# Altium project PCB_Project.PrjPcb
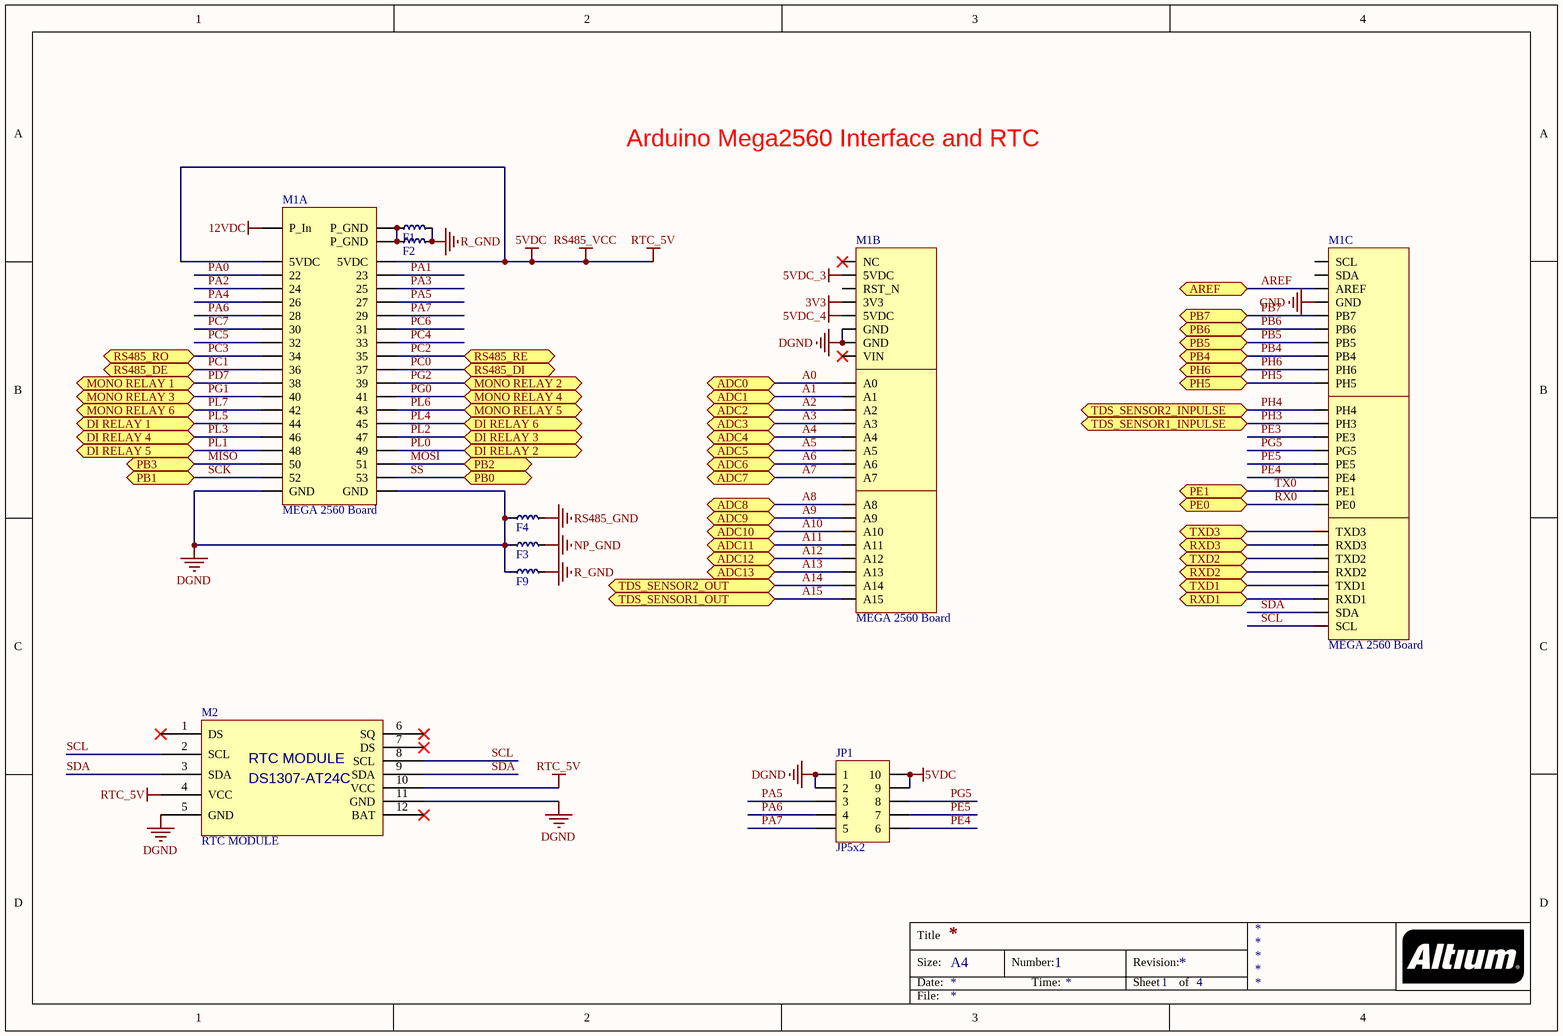
[diagram p0: Arduino_Mega2560.SchDoc]
5 sheets, 149 parts. Net scope: flat (ports and power ports of the same name join across sheets).
Board file: SmartAGR_Arduino_Version.PcbDoc
Sheets:
  Arduino_Mega2560.SchDoc
  Relay220VAC.SchDoc
  Relay12VDC.SchDoc
  RS485.SchDoc
  TDS sensor 1.SchDoc

## Sheet Arduino_Mega2560.SchDoc
size A4; DocumentNumber: 1; SheetNumber: 1; SheetTotal: 4

### Parts
F1  FBFB0805  [RESC_0603]  (value not drawn)
F2  FBFB0805  [RESC_0603]  (value not drawn)
F3  FBFB0805  [RESC_0603]  (value not drawn)
F4  FBFB0805  [RESC_0603]  (value not drawn)
F9  FBFB0805  [RESC_0603]  (value not drawn)
JP1  JP5x2  [JP5-D2T]
M1  MEGA 2560 Board  [MEGA 2560]  (parts A,B,C of 3)
M2  RTC MODULE  [MODULE RTC DS1307-AT24C]

### Ports
ADC0, ADC1, ADC2, ADC3, ADC4, ADC5, ADC6, ADC7, ADC8, ADC9, ADC10, ADC11, ADC12, ADC13, AREF, DI RELAY 1, DI RELAY 2, DI RELAY 3, DI RELAY 4, DI RELAY 5, DI RELAY 6, MONO RELAY 1, MONO RELAY 2, MONO RELAY 3, MONO RELAY 4, MONO RELAY 5, MONO RELAY 6, PB0, PB1, PB2, PB3, PB4, PB5, PB6, PB7, PE0, PE1, PH5, PH6, RS485_DE, RS485_DI, RS485_RE, RS485_RO, RXD1, RXD2, RXD3, TDS_SENSOR1_INPULSE, TDS_SENSOR1_OUT, TDS_SENSOR2_INPULSE, TDS_SENSOR2_OUT, TXD1, TXD2, TXD3

### Nets
3V3: M1.3V1(3V3)
5VDC: JP1.9 JP1.10 M1.5V1(5VDC) M1.5V2(5VDC) M2.4(VCC) M2.10(VCC)  [also labelled RS485_VCC, RTC_5V]
5VDC_3: M1.5V3(5VDC)
5VDC_4: M1.5V4(5VDC)
12VDC: M1.P_In
DGND: F3.1 F4.1 F9.1 JP1.1 JP1.2 M1.G1(GND) M1.G2(GND) M1.G3(GND) M1.G4(GND) M2.5(GND) M2.11(GND)
GND: M1.G5(GND)
NP_GND: F3.2
R_GND: F1.2 F2.2 F9.2
RS485_GND: F4.2
A0: M1.A0 ; port ADC0
A1: M1.A1 ; port ADC1
A2: M1.A2 ; port ADC2
A3: M1.A3 ; port ADC3
A4: M1.A4 ; port ADC4
A5: M1.A5 ; port ADC5
A6: M1.A6 ; port ADC6
A7: M1.A7 ; port ADC7
A8: M1.A8 ; port ADC8
A9: M1.A9 ; port ADC9
A10: M1.A10 ; port ADC10
A11: M1.A11 ; port ADC11
A12: M1.A12 ; port ADC12
A13: M1.A13 ; port ADC13
A14: M1.A14 ; port TDS_SENSOR2_OUT
A15: M1.A15 ; port TDS_SENSOR1_OUT
AREF: M1.AREF ; port AREF
MISO: M1.50 ; port PB3
MOSI: M1.51 ; port PB2
PA0: M1.22
PA1: M1.23
PA2: M1.24
PA3: M1.25
PA4: M1.26
PA5: JP1.3 M1.27
PA6: JP1.4 M1.28
PA7: JP1.5 M1.29
PB4: M1.10(PB4) ; port PB4
PB5: M1.11(PB5) ; port PB5
PB6: M1.12(PB6) ; port PB6
PB7: M1.13(PB7) ; port PB7
PC0: M1.37 ; port RS485_DI
PC1: M1.36 ; port RS485_DE
PC2: M1.35 ; port RS485_RE
PC3: M1.34 ; port RS485_RO
PC4: M1.33
PC5: M1.32
PC6: M1.31
PC7: M1.30
PD7: M1.38 ; port MONO RELAY 1
PE3: M1.5(PE3)
PE4: JP1.6 M1.2(PE4)
PE5: JP1.7 M1.3(PE5)
PG0: M1.41 ; port MONO RELAY 4
PG1: M1.40 ; port MONO RELAY 3
PG2: M1.39 ; port MONO RELAY 2
PG5: JP1.8 M1.4(PG5)
PH3: M1.6(PH3) ; port TDS_SENSOR1_INPULSE
PH4: M1.7(PH4) ; port TDS_SENSOR2_INPULSE
PH5: M1.8(PH5) ; port PH5
PH6: M1.9(PH6) ; port PH6
PL0: M1.49 ; port DI RELAY 2
PL1: M1.48 ; port DI RELAY 5
PL2: M1.47 ; port DI RELAY 3
PL3: M1.46 ; port DI RELAY 4
PL4: M1.45 ; port DI RELAY 6
PL5: M1.44 ; port DI RELAY 1
PL6: M1.43 ; port MONO RELAY 5
PL7: M1.42 ; port MONO RELAY 6
RX0: M1.0(PE0) ; port PE0
SCK: M1.52 ; port PB1
SCL: M1.21(SCL) M2.2(SCL) M2.8(SCL)
SDA: M1.20(SDA) M2.3(SDA) M2.9(SDA)
SS: M1.53 ; port PB0
TX0: M1.1(PE1) ; port PE1
NetF1_1: F1.1 F2.1 M1.PGND1(P_GND) M1.PGND2(P_GND)
NetM1_14: M1.14(TXD3) ; port TXD3
NetM1_15: M1.15(RXD3) ; port RXD3
NetM1_16: M1.16(TXD2) ; port TXD2
NetM1_17: M1.17(RXD2) ; port RXD2
NetM1_18: M1.18(TXD1) ; port TXD1
NetM1_19: M1.19(RXD1) ; port RXD1

Not connected (* = marked no-connect by the designer): M1 NC* RST(RST_N) SCL SDA VIN*; M2 1(DS)* 6(SQ)* 7(DS)* 12(BAT)*

### Notes on the sheet
- Arduino Mega2560 Interface and RTC
- Title
- Size:
- Date:
- A4
- Number:
- Time:
- Revision:
- Sheet
- of
- File:
- (in symbol RTC DS1307-AR24C) DS1307-AT24C

### Library data of the parts
F1-F4 F9 = FB0603_1000Ohm: FERRITE BEAD 1000 OHM 0603; Supplier 1: Digi-Key; Supplier Part Number 1: 587-1867-1-ND
JP1 = JP5x2: WR-PHD 2.54 mm Dual Socket Header; Manufacturer: W¨¹rth Elektronik eiSos GmbH; partNo: 61301021821; ComponentLink1 Description: Manufacturer; ComponentLink2 Description: Datasheet; NoPins: 10; Created Date: 29 March 2013; ComponentLink1URL: http://www.we-online.com; ComponentLink2URL: http://katalog.we-online.de/em/datasheet/6130xx21821.pdf; Created by: Karrer Zheng
M1 = MEGA 2560 Board: Arduino ATMEGA 2560
M2 = RTC DS1307-AR24C: RTC DS1307-AT24C

## Sheet Relay220VAC.SchDoc
size A4; DocumentNumber: 2; SheetNumber: 2; SheetTotal: 4
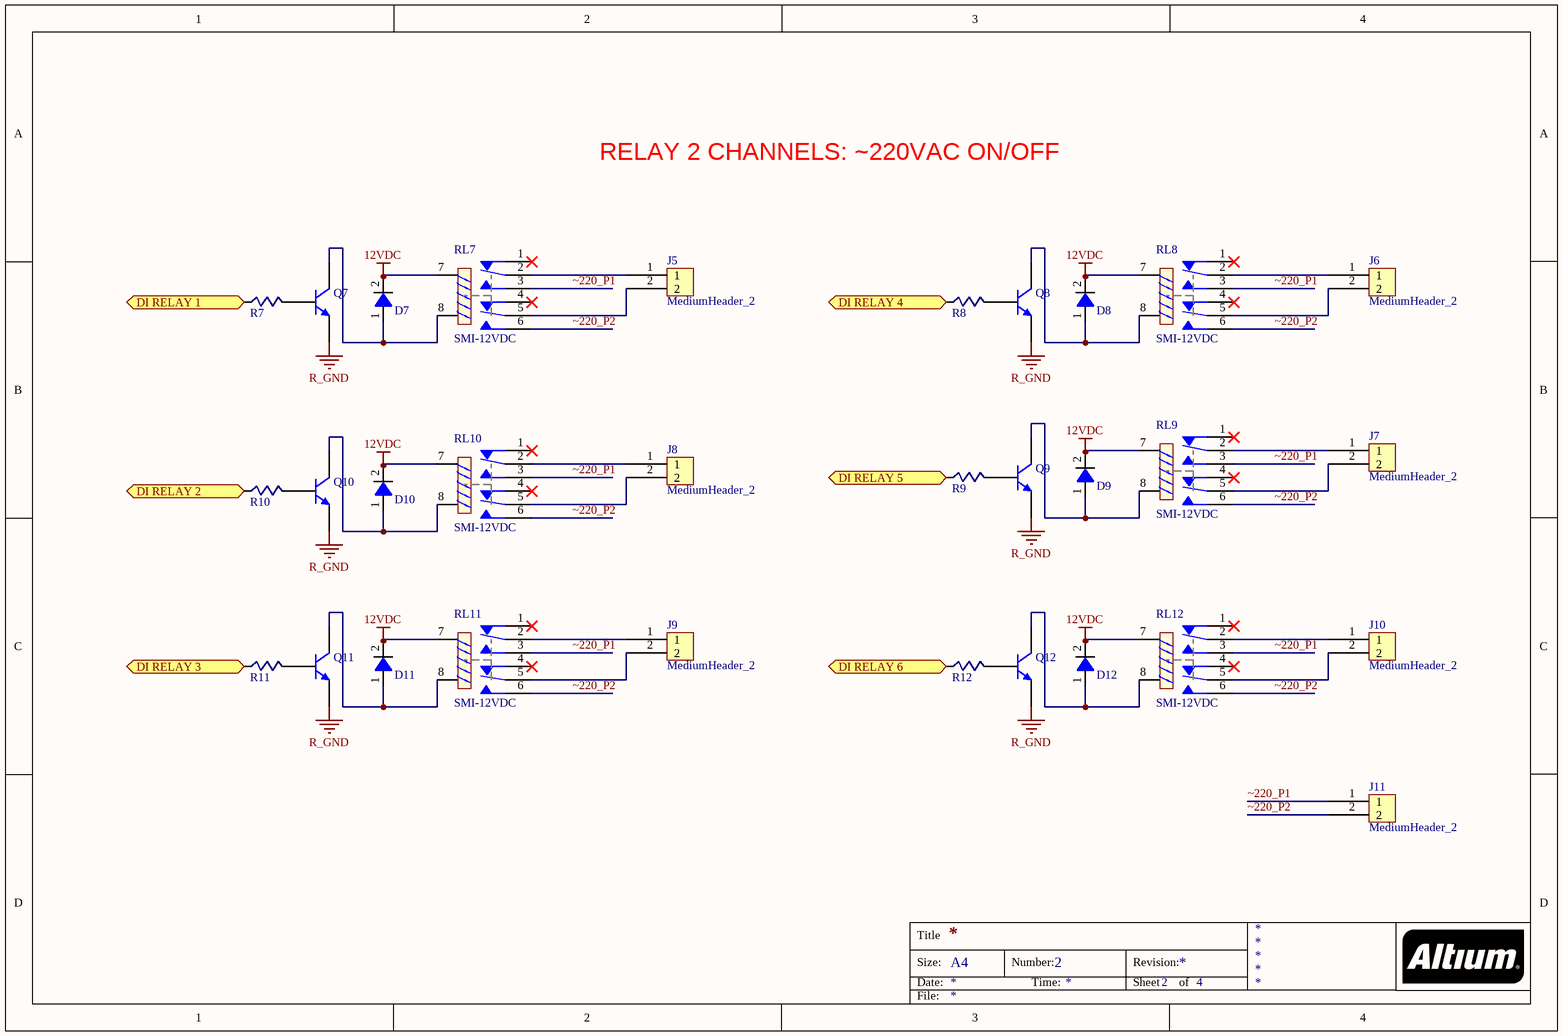
[diagram p1: Relay220VAC.SchDoc]

### Parts
D7  M7 SMD  [Diode 1N4007 SMD]  (value not drawn)
D8  M7 SMD  [Diode 1N4007 SMD]  (value not drawn)
D9  M7 SMD  [Diode 1N4007 SMD]  (value not drawn)
D10  M7 SMD  [Diode 1N4007 SMD]  (value not drawn)
D11  M7 SMD  [Diode 1N4007 SMD]  (value not drawn)
D12  M7 SMD  [Diode 1N4007 SMD]  (value not drawn)
J5  MediumHeader_2  [Medium - Header 2]
J6  MediumHeader_2  [Medium - Header 2]
J7  MediumHeader_2  [Medium - Header 2]
J8  MediumHeader_2  [Medium - Header 2]
J9  MediumHeader_2  [Medium - Header 2]
J10  MediumHeader_2  [Medium - Header 2]
J11  MediumHeader_2  [Medium - Header 2]
Q7  MMBT3904  [SOT23_L_MOD]  (value not drawn)
Q8  MMBT3904  [SOT23_L_MOD]  (value not drawn)
Q9  MMBT3904  [SOT23_L_MOD]  (value not drawn)
Q10  MMBT3904  [SOT23_L_MOD]  (value not drawn)
Q11  MMBT3904  [SOT23_L_MOD]  (value not drawn)
Q12  MMBT3904  [SOT23_L_MOD]  (value not drawn)
R7  R_1K_0603  [RES-SMD-0603]  (value not drawn)
R8  R_1K_0603  [RES-SMD-0603]  (value not drawn)
R9  R_1K_0603  [RES-SMD-0603]  (value not drawn)
R10  R_1K_0603  [RES-SMD-0603]  (value not drawn)
R11  R_1K_0603  [RES-SMD-0603]  (value not drawn)
R12  R_1K_0603  [RES-SMD-0603]  (value not drawn)
RL7  SMI-12VDC  [RELAY SMI-2P]
RL8  SMI-12VDC  [RELAY SMI-2P]
RL9  SMI-12VDC  [RELAY SMI-2P]
RL10  SMI-12VDC  [RELAY SMI-2P]
RL11  SMI-12VDC  [RELAY SMI-2P]
RL12  SMI-12VDC  [RELAY SMI-2P]

### Ports
DI RELAY 1, DI RELAY 2, DI RELAY 3, DI RELAY 4, DI RELAY 5, DI RELAY 6

### Nets
12VDC: D7.2 D8.2 D9.2 D10.2 D11.2 D12.2 RL7.7 RL8.7 RL9.7 RL10.7 RL11.7 RL12.7
R_GND: Q7.2(E) Q8.2(E) Q9.2(E) Q10.2(E) Q11.2(E) Q12.2(E)
PL0: R10.1 ; port DI RELAY 2
PL1: R9.1 ; port DI RELAY 5
PL2: R11.1 ; port DI RELAY 3
PL3: R8.1 ; port DI RELAY 4
PL4: R12.1 ; port DI RELAY 6
PL5: R7.1 ; port DI RELAY 1
~220_P1: J11.1 RL7.3 RL8.3 RL9.3 RL10.3 RL11.3 RL12.3
~220_P2: J11.2 RL7.6 RL8.6 RL9.6 RL10.6 RL11.6 RL12.6
NetD7_1: D7.1 Q7.3(C) RL7.8
NetD8_1: D8.1 Q8.3(C) RL8.8
NetD9_1: D9.1 Q9.3(C) RL9.8
NetD10_1: D10.1 Q10.3(C) RL10.8
NetD11_1: D11.1 Q11.3(C) RL11.8
NetD12_1: D12.1 Q12.3(C) RL12.8
NetJ5_1: J5.1 RL7.2
NetJ5_2: J5.2 RL7.5
NetJ6_1: J6.1 RL8.2
NetJ6_2: J6.2 RL8.5
NetJ7_1: J7.1 RL9.2
NetJ7_2: J7.2 RL9.5
NetJ8_1: J8.1 RL10.2
NetJ8_2: J8.2 RL10.5
NetJ9_1: J9.1 RL11.2
NetJ9_2: J9.2 RL11.5
NetJ10_1: J10.1 RL12.2
NetJ10_2: J10.2 RL12.5
NetQ7_1: Q7.1(B) R7.2
NetQ8_1: Q8.1(B) R8.2
NetQ9_1: Q9.1(B) R9.2
NetQ10_1: Q10.1(B) R10.2
NetQ11_1: Q11.1(B) R11.2
NetQ12_1: Q12.1(B) R12.2

Not connected (* = marked no-connect by the designer): RL7 1* 4*; RL8 1* 4*; RL9 1* 4*; RL10 1* 4*; RL11 1* 4*; RL12 1* 4*

### Notes on the sheet
- RELAY 2 CHANNELS: ~220VAC ON/OFF
- Title
- Size:
- Date:
- A4
- Number:
- Time:
- Revision:
- Sheet
- of
- File:

### Library data of the parts
D7-D12 = Diode_1N4007: DIODE GEN PURP 1KV 1A DO214AC; Supplier 1: Digi-Key; Supplier Part Number 1: 641-1018-1-ND
Q7-Q12 = MMBT3904: TRANSISTOR GP NPN AMP SOT-23; Published: 17-Sep-2003; LatestRevisionDate: 12-Dec-2006; LatestRevisionNote: IPC-7351 Footprint Added.; DatasheetVersion: 13-May-2002; PackageVersion: May-1999; PackageReference: SOT23; Publisher: Altium Limited; PackageDescription: 3-Pin SOT-23 Package 0.95 mm Pitch, 2.3 mm Lead Span; ComponentLink1Description: Manufacturer Link; ComponentLink1URL: http://www.semiconductors.philips.com/; ComponentLink2Description: Datasheet; ComponentLink2URL: http://www.semiconductors.philips.com/acrobat/datasheets/MMBT3904_4.pdf; Supplier 1: Digi-Key; Supplier Part Number 1: MMBT3904FSDKR-ND
R7-R12 = RES0603_1K: RES 1K OHM 1/10W 1% 0603 SMD; Supplier 1: Digi-Key; Supplier Part Number 1: 311-1.50KHRDKR-ND
RL7-RL12 = RELAY SMI-2P: Relay 12VDC, 2 channel

## Sheet Relay12VDC.SchDoc
size A4; DocumentNumber: 3; SheetNumber: 3; SheetTotal: 4
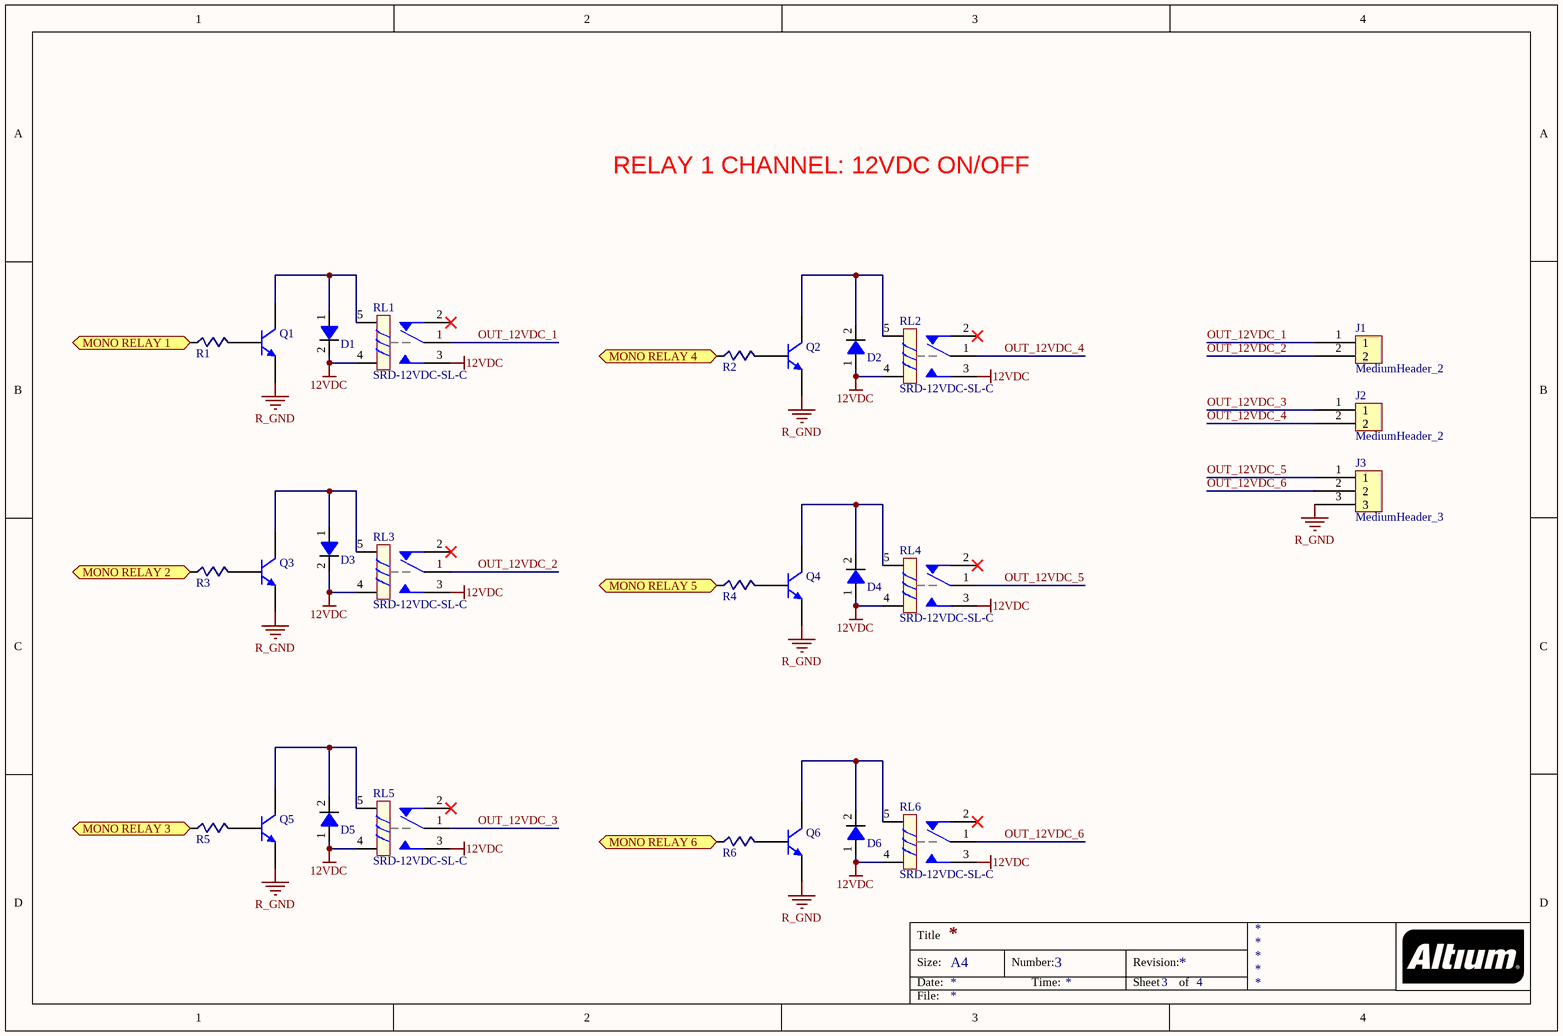
[diagram p2: Relay12VDC.SchDoc]

### Parts
D1  M7 SMD  [Diode 1N4007 SMD]  (value not drawn)
D2  M7 SMD  [Diode 1N4007 SMD]  (value not drawn)
D3  M7 SMD  [Diode 1N4007 SMD]  (value not drawn)
D4  M7 SMD  [Diode 1N4007 SMD]  (value not drawn)
D5  M7 SMD  [Diode 1N4007 SMD]  (value not drawn)
D6  M7 SMD  [Diode 1N4007 SMD]  (value not drawn)
J1  MediumHeader_2  [Medium - Header 2]
J2  MediumHeader_2  [Medium - Header 2]
J3  MediumHeader_3  [Medium - Header 3]
Q1  MMBT3904  [SOT23_L_MOD]  (value not drawn)
Q2  MMBT3904  [SOT23_L_MOD]  (value not drawn)
Q3  MMBT3904  [SOT23_L_MOD]  (value not drawn)
Q4  MMBT3904  [SOT23_L_MOD]  (value not drawn)
Q5  MMBT3904  [SOT23_L_MOD]  (value not drawn)
Q6  MMBT3904  [SOT23_L_MOD]  (value not drawn)
R1  R_1K_0603  [RES-SMD-0603]  (value not drawn)
R2  R_1K_0603  [RES-SMD-0603]  (value not drawn)
R3  R_1K_0603  [RES-SMD-0603]  (value not drawn)
R4  R_1K_0603  [RES-SMD-0603]  (value not drawn)
R5  R_1K_0603  [RES-SMD-0603]  (value not drawn)
R6  R_1K_0603  [RES-SMD-0603]  (value not drawn)
RL1  SRD-12VDC-SL-C  [RELAY SRD-12VDC]
RL2  SRD-12VDC-SL-C  [RELAY SRD-12VDC]
RL3  SRD-12VDC-SL-C  [RELAY SRD-12VDC]
RL4  SRD-12VDC-SL-C  [RELAY SRD-12VDC]
RL5  SRD-12VDC-SL-C  [RELAY SRD-12VDC]
RL6  SRD-12VDC-SL-C  [RELAY SRD-12VDC]

### Ports
MONO RELAY 1, MONO RELAY 2, MONO RELAY 3, MONO RELAY 4, MONO RELAY 5, MONO RELAY 6

### Nets
12VDC: D1.2 D2.1 D3.2 D4.1 D5.1 D6.1 RL1.3 RL1.4 RL2.3 RL2.4 RL3.3 RL3.4 RL4.3 RL4.4 RL5.3 RL5.4 RL6.3 RL6.4
R_GND: J3.3 Q1.2(E) Q2.2(E) Q3.2(E) Q4.2(E) Q5.2(E) Q6.2(E)
OUT_12VDC_1: J1.1 RL1.1
OUT_12VDC_2: J1.2 RL3.1
OUT_12VDC_3: J2.1 RL5.1
OUT_12VDC_4: J2.2 RL2.1
OUT_12VDC_5: J3.1 RL4.1
OUT_12VDC_6: J3.2 RL6.1
PD7: R1.1 ; port MONO RELAY 1
PG0: R2.1 ; port MONO RELAY 4
PG1: R5.1 ; port MONO RELAY 3
PG2: R3.1 ; port MONO RELAY 2
PL6: R4.1 ; port MONO RELAY 5
PL7: R6.1 ; port MONO RELAY 6
NetD1_1: D1.1 Q1.3(C) RL1.5
NetD2_2: D2.2 Q2.3(C) RL2.5
NetD3_1: D3.1 Q3.3(C) RL3.5
NetD4_2: D4.2 Q4.3(C) RL4.5
NetD5_2: D5.2 Q5.3(C) RL5.5
NetD6_2: D6.2 Q6.3(C) RL6.5
NetQ1_1: Q1.1(B) R1.2
NetQ2_1: Q2.1(B) R2.2
NetQ3_1: Q3.1(B) R3.2
NetQ4_1: Q4.1(B) R4.2
NetQ5_1: Q5.1(B) R5.2
NetQ6_1: Q6.1(B) R6.2

Not connected (* = marked no-connect by the designer): RL1 2*; RL2 2*; RL3 2*; RL4 2*; RL5 2*; RL6 2*

### Notes on the sheet
- RELAY 1 CHANNEL: 12VDC ON/OFF
- Title
- Size:
- Date:
- A4
- Number:
- Time:
- Revision:
- Sheet
- of
- File:

### Library data of the parts
D1-D6 = Diode_1N4007: DIODE GEN PURP 1KV 1A DO214AC; Supplier 1: Digi-Key; Supplier Part Number 1: 641-1018-1-ND
Q1-Q6 = MMBT3904: TRANSISTOR GP NPN AMP SOT-23; Published: 17-Sep-2003; LatestRevisionDate: 12-Dec-2006; LatestRevisionNote: IPC-7351 Footprint Added.; DatasheetVersion: 13-May-2002; PackageVersion: May-1999; PackageReference: SOT23; Publisher: Altium Limited; PackageDescription: 3-Pin SOT-23 Package 0.95 mm Pitch, 2.3 mm Lead Span; ComponentLink1Description: Manufacturer Link; ComponentLink1URL: http://www.semiconductors.philips.com/; ComponentLink2Description: Datasheet; ComponentLink2URL: http://www.semiconductors.philips.com/acrobat/datasheets/MMBT3904_4.pdf; Supplier 1: Digi-Key; Supplier Part Number 1: MMBT3904FSDKR-ND
R1-R6 = RES0603_1K: RES 1K OHM 1/10W 1% 0603 SMD; Supplier 1: Digi-Key; Supplier Part Number 1: 311-1.50KHRDKR-ND
RL1-RL6 = RELAY SRD-12VDC: Relay SPDT,10A - 12VDC 5 Pin; Value: Relay SPDT, 10A, 12V

## Sheet RS485.SchDoc
size A4
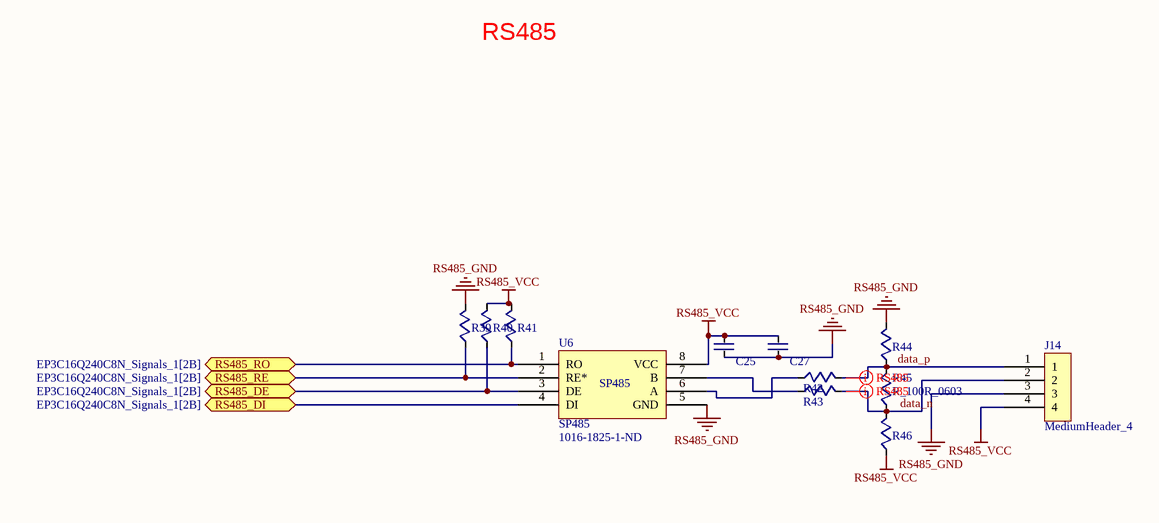
[diagram p3: RS485.SchDoc]

### Parts
C25  100n Cer  [CN-SMD-0805]  (value not drawn)
C27  10n Cer  [CN-SMD-0805]  (value not drawn)
J14  MediumHeader_4  [Medium - Header 4]
R39  R_10K_0603  [RESC_0603]  (value not drawn)
R40  R_10K_0603  [RESC_0603]  (value not drawn)
R41  R_4K99_0603  [RESC_0603]  (value not drawn)
R42  R_10K_0603  [RESC_0603]  (value not drawn)
R43  R_10R_0603  [RESC_0603]  (value not drawn)
R44  R_2K_0603  [RESC_0603]  (value not drawn)
R45  R_100R_0603  [RESC_0603]
R46  R_2K_0603  [RESC_0603]  (value not drawn)
U6  SP485  Supplier Part Number 1: 1016-1825-1-ND  [SOP8]

### Ports
RS485_DE (see EP3C16Q240C8N_Signals_1[2B]), RS485_DI (see EP3C16Q240C8N_Signals_1[2B]), RS485_RE (see EP3C16Q240C8N_Signals_1[2B]), RS485_RO (see EP3C16Q240C8N_Signals_1[2B])

### Nets
RS485_GND: C25.1 C27.1 J14.3 R39.2 R44.2 U6.5(GND)
RS485_VCC: C25.2 C27.2 J14.4 R40.2 R41.2 R46.1 U6.8(VCC)  [project net 5VDC]
data_n: J14.2 R43.2 R45.1 R46.2
data_p: J14.1 R42.2 R44.1 R45.2
PC0: U6.4(DI) ; port RS485_DI
PC1: R40.1 U6.3(DE) ; port RS485_DE
PC2: R39.1 U6.2(RE*) ; port RS485_RE
PC3: R41.1 U6.1(RO) ; port RS485_RO
NetR42_1: R42.1 U6.6(A)
NetR43_1: R43.1 U6.7(B)

### Layout directives
differential pair: data_n, data_p

### Notes on the sheet
- RS485
- Title
- Size:
- Date:
- A4
- Number:
- Time:
- Revision:
- Sheet
- of
- File:

### Library data of the parts
C25 = CAPC0805_104: CAP CER 0.1UF 25V 10% X7R 0805; Supplier 1: Digi-Key; Supplier Part Number 1: 399-1168-2-ND
C27 = CAPC0805_103: CAP CER 10000PF 100V X7R 0805; Supplier 1: Digi-Key; Supplier Part Number 1: 399-1159-1-ND
R39 R40 R42 = RES0603_10K: RES 10.0K OHM 1/10W 1% 0603 SMD; Supplier 1: Digi-Key; Supplier Part Number 1: 311-10.0KHRCT-ND
R41 = RES0603_4K99: RES 4.99K OHM 1/10W 1% 0603 SMD; Supplier 1: Digi-Key; Supplier Part Number 1: P4.99KHDKR-ND
R43 = RES0603_10R: RES 10.0 OHM 1/10W 0603 SMD; Supplier 1: Digi-Key; Supplier Part Number 1: 311-10.0HRCT-ND
R44 R46 = RES0603_2K: RES 2K OHM 1/10W 0603 SMD; Supplier 1: Digi-Key; Supplier Part Number 1: P2.0KDBDKR-ND
R45 = RES0603_100R: RES 100 OHM 1/10W 5% 0603 SMD; Supplier 1: Digi-Key; Supplier Part Number 1: P100GDKR-ND
U6 = SP485: IC TXRX RS485 HALF DUPLEX 8SOIC; Supplier 1: Digi-Key

## Sheet TDS sensor 1.SchDoc
size A4; DocumentNumber: 4; SheetNumber: 4; SheetTotal: 4
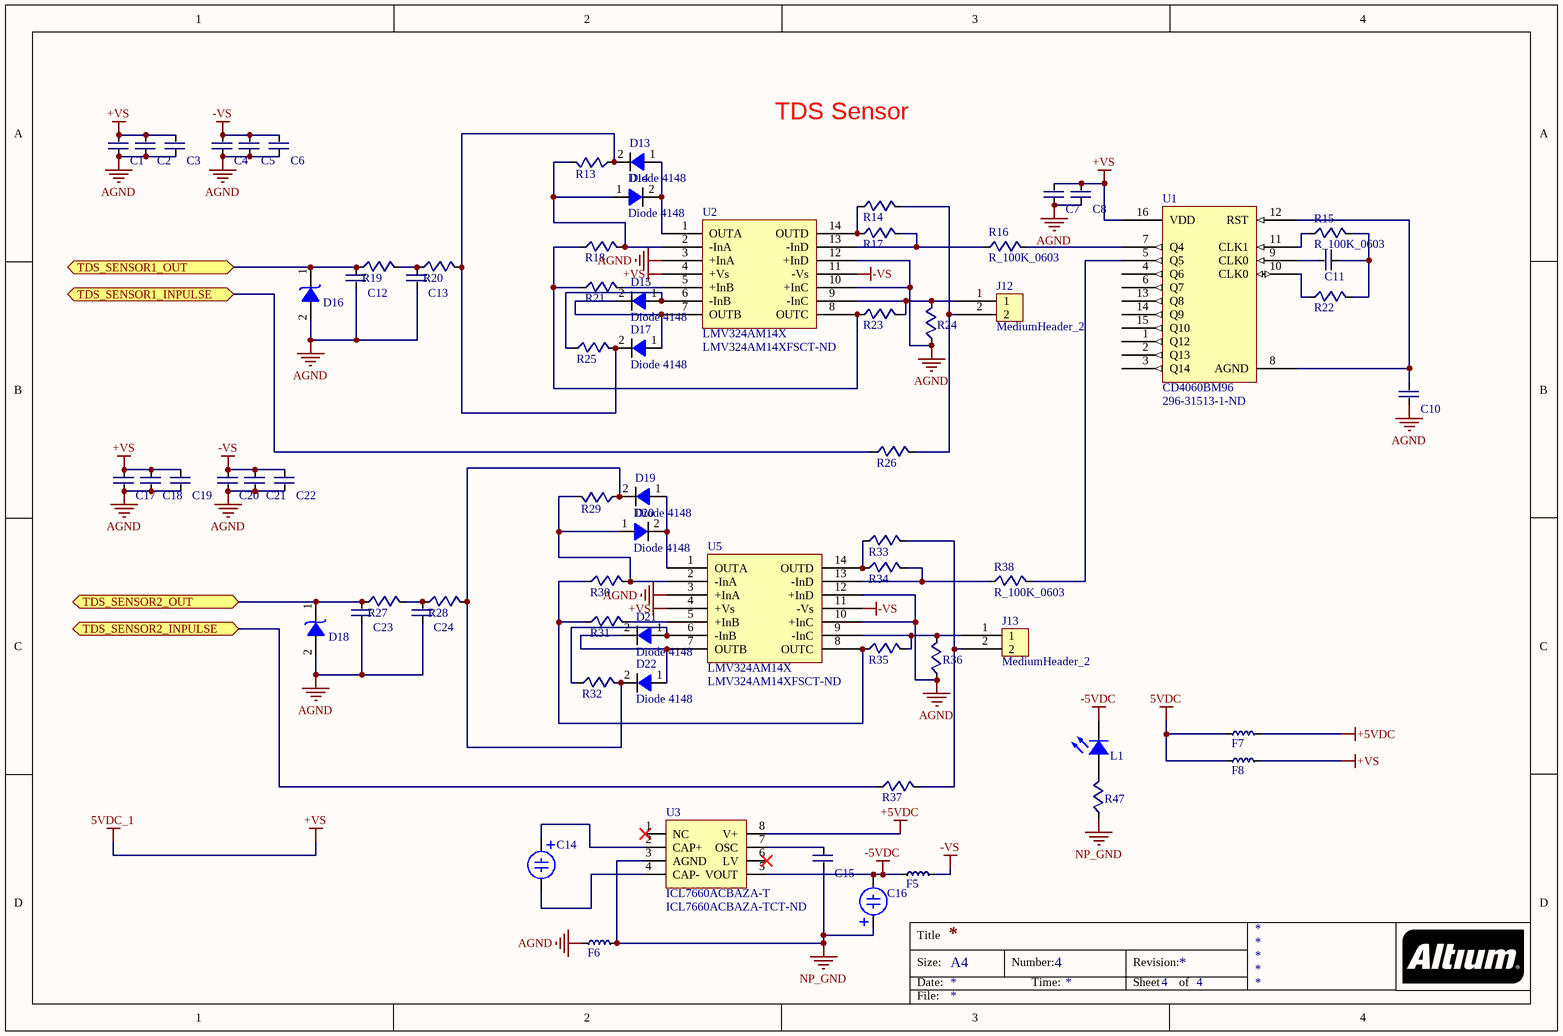
[diagram p4: TDS sensor 1.SchDoc]

### Parts
C1  100n Cer  [CN-SMD-0805]  (value not drawn)
C2  1n Cer  [CN-SMD-0805]  (value not drawn)
C3  10n Cer  [CN-SMD-0805]  (value not drawn)
C4  100n Cer  [CN-SMD-0805]  (value not drawn)
C5  1n Cer  [CN-SMD-0805]  (value not drawn)
C6  10n Cer  [CN-SMD-0805]  (value not drawn)
C7  10n Cer  [CN-SMD-0805]  (value not drawn)
C8  100n Cer  [CN-SMD-0805]  (value not drawn)
C10  100n Cer  [CN-SMD-0805]  (value not drawn)
C11  1n Cer  [CN-SMD-0805]  (value not drawn)
C12  10u Cer  [CN-SMD-0805]  (value not drawn)
C13  10u Cer  [CN-SMD-0805]  (value not drawn)
C14  CAP ALUM 100UF 25V 20% SMDL  [CAPALU_SM_5.3x5.3]  (value not drawn)
C15  100n Cer  [CN-SMD-0805]  (value not drawn)
C16  CAP ALUM 100UF 25V 20% SMDL  [CAPALU_SM_5.3x5.3]  (value not drawn)
C17  100n Cer  [CN-SMD-0805]  (value not drawn)
C18  1n Cer  [CN-SMD-0805]  (value not drawn)
C19  10n Cer  [CN-SMD-0805]  (value not drawn)
C20  100n Cer  [CN-SMD-0805]  (value not drawn)
C21  1n Cer  [CN-SMD-0805]  (value not drawn)
C22  10n Cer  [CN-SMD-0805]  (value not drawn)
C23  10u Cer  [CN-SMD-0805]  (value not drawn)
C24  10u Cer  [CN-SMD-0805]  (value not drawn)
D13  Diode 4148  [CD3216-1206]
D14  Diode 4148  [CD3216-1206]
D15  Diode 4148  [CD3216-1206]
D16  Diode_SS34  [DO-214AB_MOD_EXT]  (value not drawn)
D17  Diode 4148  [CD3216-1206]
D18  Diode_SS34  [DO-214AB_MOD_EXT]  (value not drawn)
D19  Diode 4148  [CD3216-1206]
D20  Diode 4148  [CD3216-1206]
D21  Diode 4148  [CD3216-1206]
D22  Diode 4148  [CD3216-1206]
F5  FBFB0805  [RESC_0603]  (value not drawn)
F6  FBFB0805  [RESC_0603]  (value not drawn)
F7  FBFB0805  [RESC_0603]  (value not drawn)
F8  FBFB0805  [RESC_0603]  (value not drawn)
J12  MediumHeader_2  [Medium - Header 2]
J13  MediumHeader_2  [Medium - Header 2]
L1  LTST-C171KRKT  [LED_0805]  (value not drawn)
R13  R_10K_0603  [RES-SMD-0603]  (value not drawn)
R14  R_0R_0603  [RES-SMD-0603]  (value not drawn)
R15  R_100K_0603  [RES-SMD-0603]
R16  R_100K_0603  [RES-SMD-0603]
R17  R_4K99_0603  [RES-SMD-0603]  (value not drawn)
R18  R_10K_0603  [RES-SMD-0603]  (value not drawn)
R19  R_10K_0603  [RES-SMD-0603]  (value not drawn)
R20  R_10K_0603  [RES-SMD-0603]  (value not drawn)
R21  R_10K_0603  [RES-SMD-0603]  (value not drawn)
R22  R_10K_0603  [RES-SMD-0603]  (value not drawn)
R23  R_4K99_0603  [RES-SMD-0603]  (value not drawn)
R24  R_1M_0603  [RES-SMD-0603]  (value not drawn)
R25  R_10K_0603  [RES-SMD-0603]  (value not drawn)
R26  R_0R_0603  [RES-SMD-0603]  (value not drawn)
R27  R_10K_0603  [RES-SMD-0603]  (value not drawn)
R28  R_10K_0603  [RES-SMD-0603]  (value not drawn)
R29  R_10K_0603  [RES-SMD-0603]  (value not drawn)
R30  R_10K_0603  [RES-SMD-0603]  (value not drawn)
R31  R_10K_0603  [RES-SMD-0603]  (value not drawn)
R32  R_10K_0603  [RES-SMD-0603]  (value not drawn)
R33  R_0R_0603  [RES-SMD-0603]  (value not drawn)
R34  R_4K99_0603  [RES-SMD-0603]  (value not drawn)
R35  R_4K99_0603  [RES-SMD-0603]  (value not drawn)
R36  R_1M_0603  [RES-SMD-0603]  (value not drawn)
R37  R_0R_0603  [RES-SMD-0603]  (value not drawn)
R38  R_100K_0603  [RES-SMD-0603]
R47  R_560R_0603  [RES-SMD-0603]  (value not drawn)
U1  CD4060BM96  Supplier Part Number 1: 296-31513-1-ND  [SOIC_16]
U2  LMV324AM14X  Supplier Part Number 1: LMV324AM14XFSCT-ND  [SOIC-14]
U3  ICL7660ACBAZA-T  Supplier Part Number 1: ICL7660ACBAZA-TCT-ND  [SOIC-8_MOD_24LC128]
U5  LMV324AM14X  Supplier Part Number 1: LMV324AM14XFSCT-ND  [SOIC-14]

### Ports
TDS_SENSOR1_INPULSE, TDS_SENSOR1_OUT, TDS_SENSOR2_INPULSE, TDS_SENSOR2_OUT

### Nets
5VDC: F7.1 F8.1
+5VDC: F7.2 U3.8(V+)
+VS: C1.2 C2.2 C3.2 C7.2 C8.2 C17.2 C18.2 C19.2 F8.2 U1.16(VDD) U2.4(+Vs) U5.4(+Vs)  [also labelled 5VDC_1]
-5VDC: C16.2 F5.1 L1.2(K) U3.5(VOUT)
-VS: C4.2 C5.2 C6.2 C20.2 C21.2 C22.2 F5.2 U2.11(-Vs) U5.11(-Vs)
AGND: C1.1 C2.1 C3.1 C4.1 C5.1 C6.1 C7.1 C8.1 C10.1 C12.1 C13.1 C17.1 C18.1 C19.1 C20.1 C21.1 C22.1 C23.1 C24.1 D16.2 D18.2 F6.1 R24.1 R36.1 U2.3(+InA) U2.10(+InC) U2.12(+InD) U5.3(+InA) U5.10(+InC) U5.12(+InD)
NP_GND: C15.1 C16.1 F6.2 R47.1 U3.3(AGND)
A14: C23.2 D18.1 R27.1 ; port TDS_SENSOR2_OUT
A15: C12.2 D16.1 R19.1 ; port TDS_SENSOR1_OUT
PH3: R26.1 ; port TDS_SENSOR1_INPULSE
PH4: R37.1 ; port TDS_SENSOR2_INPULSE
NetC10_2: C10.2 U1.8(AGND) U1.12(RST)
NetC11_1: C11.1 U1.9(CLK0)
NetC11_2: C11.2 R15.2 R22.2
NetC13_2: C13.2 R19.2 R20.1
NetC14_1: C14.1 U3.2(CAP+)
NetC14_2: C14.2 U3.4(CAP-)
NetC15_2: C15.2 U3.7(OSC)
NetC24_2: C24.2 R27.2 R28.1
NetD13_1: D13.1 D14.2 U2.1(OUTA)
NetD13_2: D13.2 D17.2 R13.1 R20.2 R25.2
NetD14_1: D14.1 R13.2 R18.2 U2.2(-InA)
NetD15_1: D15.1 R25.1 U2.6(-InB)
NetD15_2: D15.2 D17.1 U2.7(OUTB)
NetD19_1: D19.1 D20.2 U5.1(OUTA)
NetD19_2: D19.2 D22.2 R28.2 R29.1 R32.2
NetD20_1: D20.1 R29.2 R30.2 U5.2(-InA)
NetD21_1: D21.1 R32.1 U5.6(-InB)
NetD21_2: D21.2 D22.1 U5.7(OUTB)
NetJ12_1: J12.1 R23.2 R24.2 U2.9(-InC)
NetJ12_2: J12.2 R14.2 R26.2
NetJ13_1: J13.1 R35.2 R36.2 U5.9(-InC)
NetJ13_2: J13.2 R33.2 R37.2
NetL1_1: L1.1(A) R47.2
NetR14_1: R14.1 R17.1 U2.14(OUTD)
NetR15_1: R15.1 U1.11(CLK1)
NetR16_1: R16.1 R17.2 U2.13(-InD)
NetR16_2: R16.2 U1.7(Q4)
NetR18_1: R18.1 R21.1 R23.1 U2.8(OUTC)
NetR21_2: R21.2 U2.5(+InB)
NetR22_1: R22.1 U1.10(CLK0)
NetR30_1: R30.1 R31.1 R35.1 U5.8(OUTC)
NetR31_2: R31.2 U5.5(+InB)
NetR33_1: R33.1 R34.1 U5.14(OUTD)
NetR34_2: R34.2 R38.1 U5.13(-InD)
NetR38_2: R38.2 U1.5(Q5)

Not connected (* = marked no-connect by the designer): U1 1(Q12) 2(Q13) 3(Q14) 4(Q6) 6(Q7) 13(Q8) 14(Q9) 15(Q10); U3 1(NC)* 6(LV)*

### Notes on the sheet
- TDS Sensor
- Title
- Size:
- Date:
- A4
- Number:
- Time:
- Revision:
- Sheet
- of
- File:

### Library data of the parts
C1 C4 C8 C10 C15 C17 C20 = CAPC0805_104: CAP CER 0.1UF 25V 10% X7R 0805; Supplier 1: Digi-Key; Supplier Part Number 1: 399-1168-2-ND
C2 C5 C11 C18 C21 = CAPC0805_102: CAP CER 1000PF 50V 10% X7R 0805; Supplier 1: Digi-Key; Supplier Part Number 1: 399-1147-1-ND
C3 C6 C7 C19 C22 = CAPC0805_103: CAP CER 10000PF 100V X7R 0805; Supplier 1: Digi-Key; Supplier Part Number 1: 399-1159-1-ND
C12 C13 C23 C24 = CAPC0805_106: CAP CER 10UF 6.3V 10% X7R 0805; Supplier 1: Digi-Key; Supplier Part Number 1: 587-2780-2-ND
C14 C16 = CAPALU100U25V: CAP ALUM 100UF 25V 20% SMD; Supplier 1: Digi-Key; Supplier Part Number 1: 493-2113-1-ND
D13-D15 D17 D19-D22 = Diode_4148: DIODE SWITCHING 75V 0.2A LLDS; Supplier 1: Digi-Key; Supplier Part Number 1: 568-1749-1-ND
D16 D18 = Diode_SS34: DIODE SCHOTTKY 40V 3A SMC; Supplier 1: Digi-Key; Supplier Part Number 1: SS34FSCT-ND
F5-F8 = FB0603_1000Ohm: FERRITE BEAD 1000 OHM 0603; Supplier 1: Digi-Key; Supplier Part Number 1: 587-1867-1-ND
L1 = LED0805_RED: LED RED CLEAR 0805 SMD; Manufacturer: Generic Components; Class: Optoelectronic; Published: 08/06/2000; Publisher: Altium Hobart Technology Centre; SubClass: LED; Supplier 1: Digi-Key; Supplier Part Number 1: 160-1427-1-ND
R13 R18-R22 R25 R27-R32 = RES0603_10K: RES 10.0K OHM 1/10W 1% 0603 SMD; Supplier 1: Digi-Key; Supplier Part Number 1: 311-10.0KHRCT-ND
R14 R26 R33 R37 = RES0603_0R: RES 0.0 OHM 1/10W JUMP 0603 SMD; Supplier 1: Digi-Key; Supplier Part Number 1: 311-0.0GRDKR-ND
R15 R16 R38 = RES0603_100K: RES 100K OHM 1/10W 1% 0603 SMD; Supplier 1: Digi-Key; Supplier Part Number 1: 311-1.50KHRDKR-ND
R17 R23 R34 R35 = RES0603_4K99: RES 4.99K OHM 1/10W 1% 0603 SMD; Supplier 1: Digi-Key; Supplier Part Number 1: P4.99KHDKR-ND
R24 R36 = RES0603_1M: RES 1M OHM 1/8W 1% 0603 SMD; Supplier 1: Digi-Key; Supplier Part Number 1: 311-1.50KHRDKR-ND
R47 = RES0603_560R: RES 560 OHM 1/10W 0603 SMD; Supplier 1: Digi-Key; Supplier Part Number 1: 311-560HRTR-ND
U1 = CD4060BM: IC BINARY COUNTER/DIV/OSC 16SOIC; Supplier 1: Digi-Key
U2 U5 = LMV324A: IC OPAMP VFB 1.4MHZ RRO 14SOIC; Supplier 1: Digi-Key
U3 = ICL7660: IC REG SWTCHD CAP INV 45MA 8SOIC; Creator: Nguyen Ba Bien; Supplier 1: Digi-Key

## Nets that join several sheets
5VDC: Arduino_Mega2560 (6 pins), RS485 (7 pins), TDS sensor 1 (F7.1 F8.1)
12VDC: Arduino_Mega2560 (M1.P_In), Relay220VAC (12 pins), Relay12VDC (18 pins)
NP_GND: Arduino_Mega2560 (F3.2), TDS sensor 1 (5 pins)
R_GND: Arduino_Mega2560 (F1.2 F2.2 F9.2), Relay220VAC (6 pins), Relay12VDC (7 pins)
RS485_GND: Arduino_Mega2560 (F4.2), RS485 (6 pins)
A14: Arduino_Mega2560 (M1.A14), TDS sensor 1 (C23.2 D18.1 R27.1)
A15: Arduino_Mega2560 (M1.A15), TDS sensor 1 (C12.2 D16.1 R19.1)
PC0: Arduino_Mega2560 (M1.37), RS485 (U6.4)
PC1: Arduino_Mega2560 (M1.36), RS485 (R40.1 U6.3)
PC2: Arduino_Mega2560 (M1.35), RS485 (R39.1 U6.2)
PC3: Arduino_Mega2560 (M1.34), RS485 (R41.1 U6.1)
PD7: Arduino_Mega2560 (M1.38), Relay12VDC (R1.1)
PG0: Arduino_Mega2560 (M1.41), Relay12VDC (R2.1)
PG1: Arduino_Mega2560 (M1.40), Relay12VDC (R5.1)
PG2: Arduino_Mega2560 (M1.39), Relay12VDC (R3.1)
PH3: Arduino_Mega2560 (M1.6), TDS sensor 1 (R26.1)
PH4: Arduino_Mega2560 (M1.7), TDS sensor 1 (R37.1)
PL0: Arduino_Mega2560 (M1.49), Relay220VAC (R10.1)
PL1: Arduino_Mega2560 (M1.48), Relay220VAC (R9.1)
PL2: Arduino_Mega2560 (M1.47), Relay220VAC (R11.1)
PL3: Arduino_Mega2560 (M1.46), Relay220VAC (R8.1)
PL4: Arduino_Mega2560 (M1.45), Relay220VAC (R12.1)
PL5: Arduino_Mega2560 (M1.44), Relay220VAC (R7.1)
PL6: Arduino_Mega2560 (M1.43), Relay12VDC (R4.1)
PL7: Arduino_Mega2560 (M1.42), Relay12VDC (R6.1)